# Altium schematic sheet LOGIC_IO.SchDoc
size Tabloid; SheetNumber: 5; SheetTotal: 9
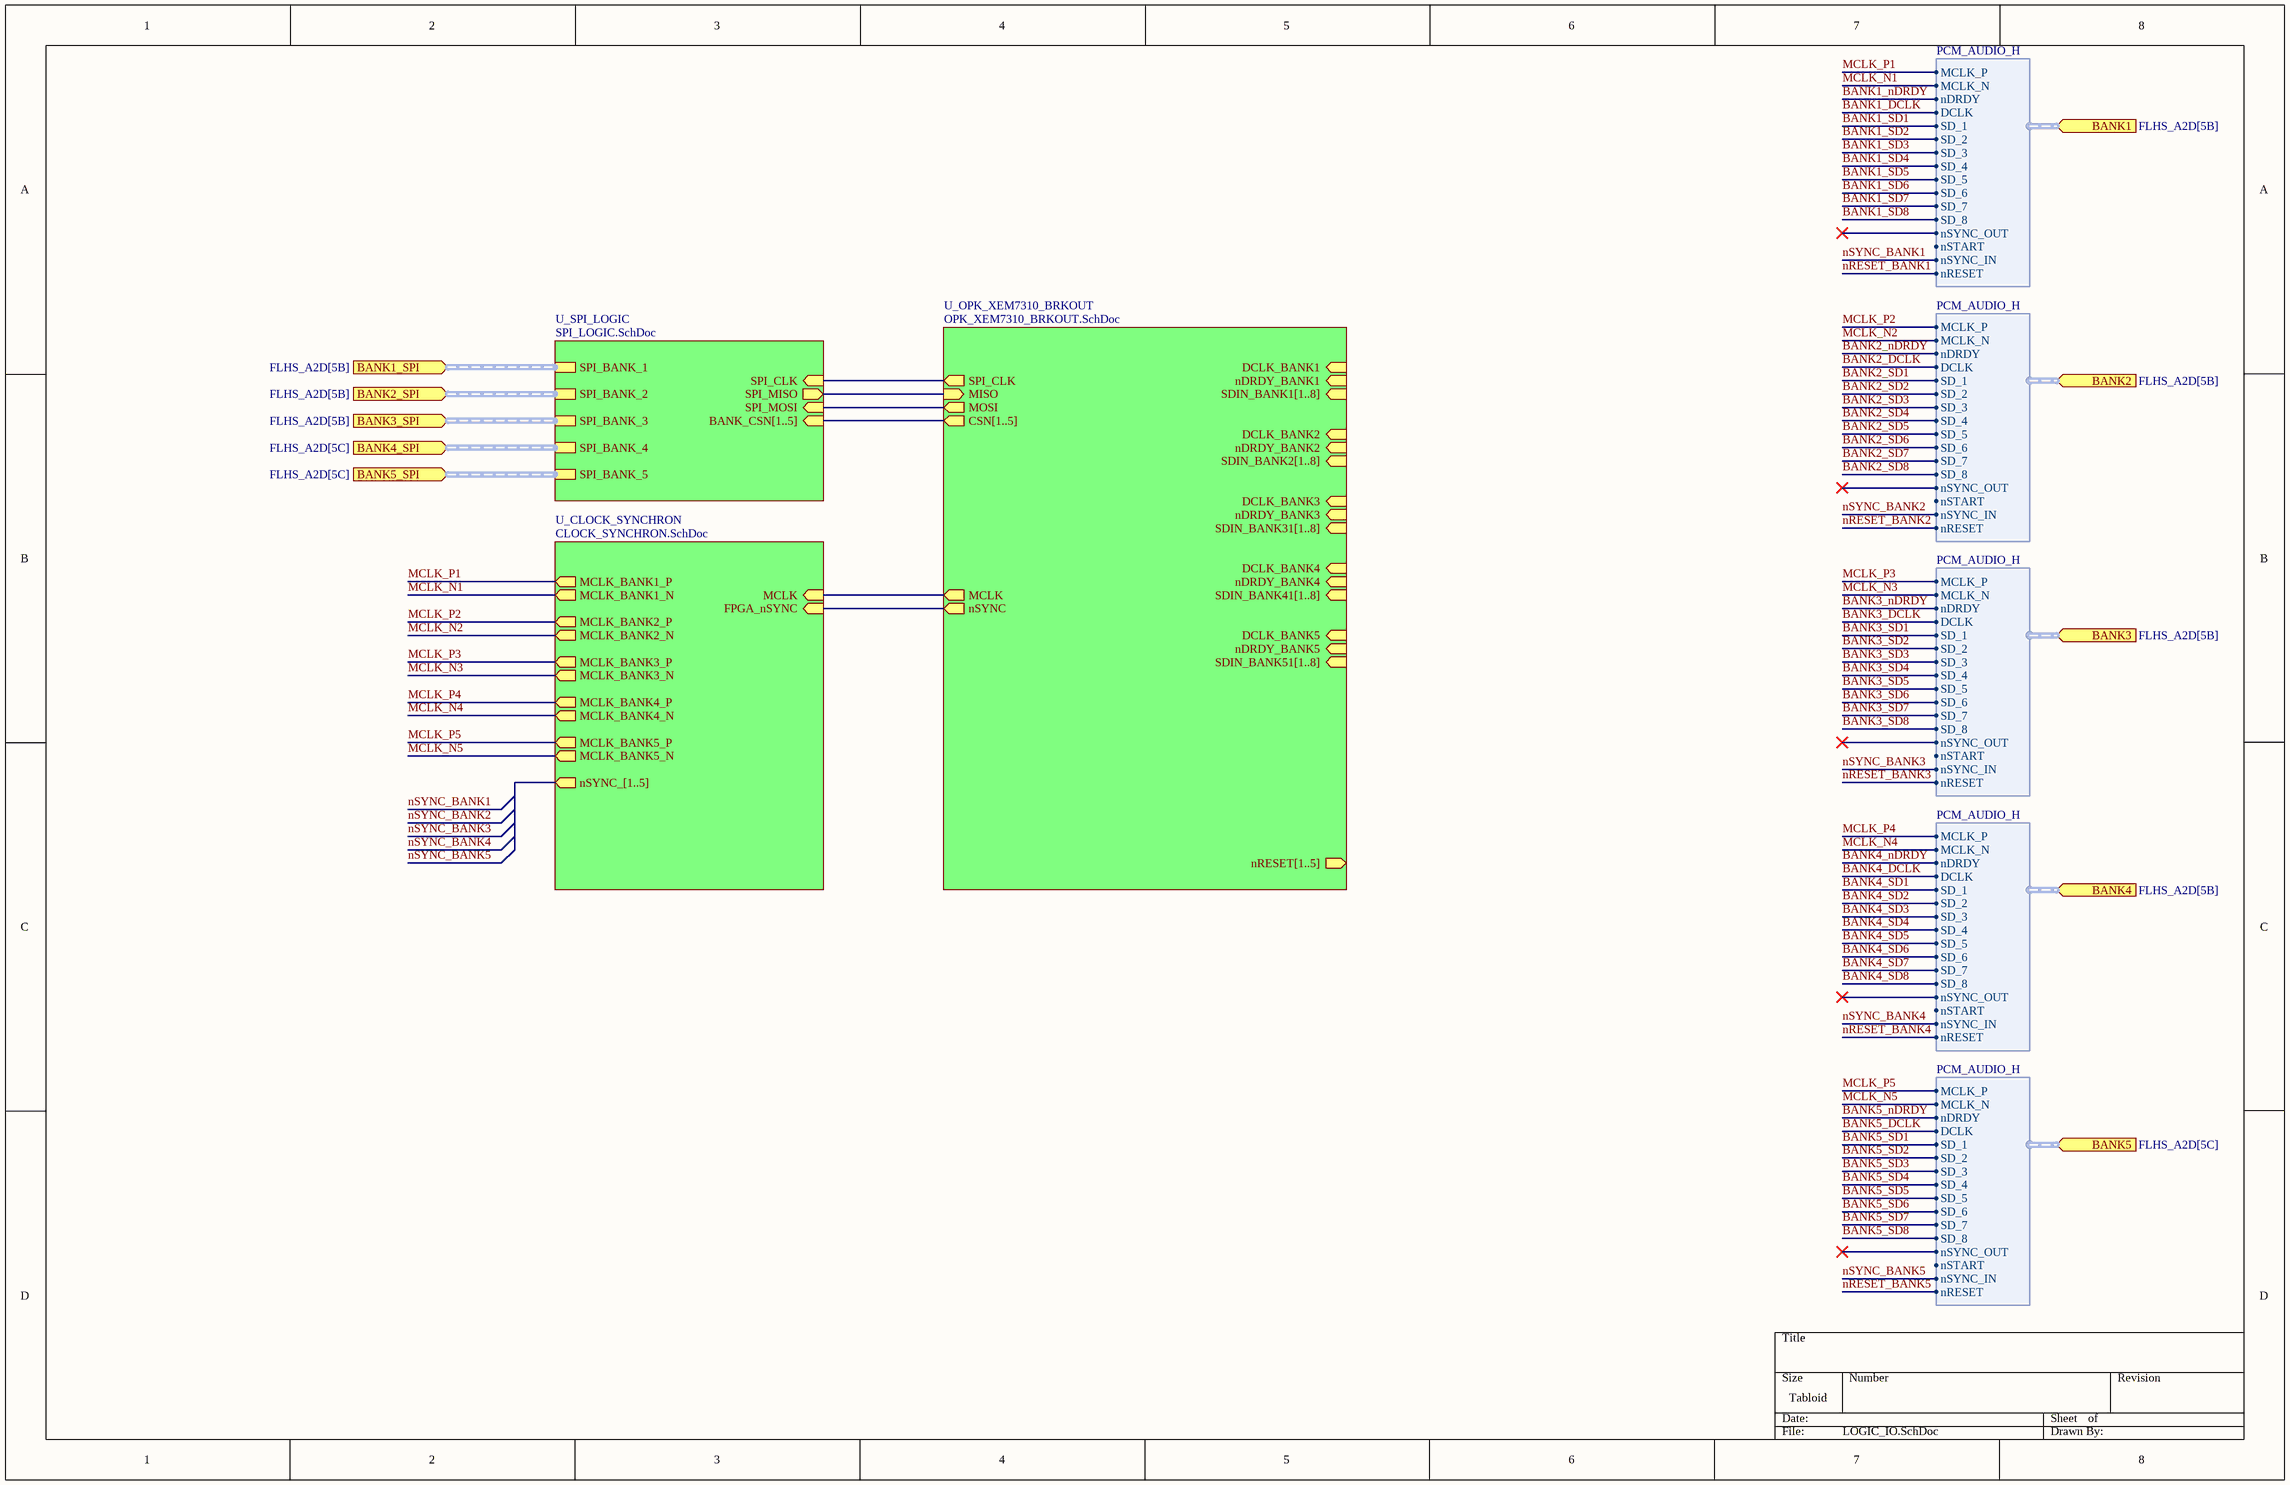
[diagram p0: LOGIC_IO.SchDoc]

## Sub-sheets
U_CLOCK_SYNCHRON = CLOCK_SYNCHRON.SchDoc: MCLK_BANK1_P (out), MCLK_BANK1_N (out), MCLK_BANK2_P (out), MCLK_BANK2_N (out), MCLK_BANK3_P (out), MCLK_BANK3_N (out), MCLK_BANK4_P (out), MCLK_BANK4_N (out), MCLK_BANK5_P (out), MCLK_BANK5_N (out), MCLK (in), nSYNC_[1..5] (out), FPGA_nSYNC (in)
U_OPK_XEM7310_BRKOUT = OPK_XEM7310_BRKOUT.SchDoc: nRESET[1..5] (out), nDRDY_BANK1 (in), SDIN_BANK1[1..8] (in), nDRDY_BANK2 (in), SDIN_BANK2[1..8] (in), nDRDY_BANK3 (in), SDIN_BANK31[1..8] (in), nDRDY_BANK4 (in), SDIN_BANK41[1..8] (in), nDRDY_BANK5 (in), SDIN_BANK51[1..8] (in), MCLK (out), nSYNC (out), SPI_CLK (out), MOSI (out), MISO (in), CSN[1..5] (out), DCLK_BANK1 (in), DCLK_BANK2 (in), DCLK_BANK3 (in), DCLK_BANK4 (in), DCLK_BANK5 (in)
U_SPI_LOGIC = SPI_LOGIC.SchDoc: SPI_BANK_1 (harness PCM_SPI_CONFIG_H), SPI_BANK_2 (harness PCM_SPI_CONFIG_H), SPI_BANK_3 (harness PCM_SPI_CONFIG_H), SPI_BANK_4 (harness PCM_SPI_CONFIG_H), SPI_BANK_5 (harness PCM_SPI_CONFIG_H), SPI_MISO (out), SPI_CLK (in), SPI_MOSI (in), BANK_CSN[1..5] (in)

## Ports
BANK1 (in, harness PCM_AUDIO_H, see FLHS_A2D[5B]), BANK1_SPI (in, harness PCM_SPI_CONFIG_H, see FLHS_A2D[5B]), BANK2 (in, harness PCM_AUDIO_H, see FLHS_A2D[5B]), BANK2_SPI (in, harness PCM_SPI_CONFIG_H, see FLHS_A2D[5B]), BANK3 (in, harness PCM_AUDIO_H, see FLHS_A2D[5B]), BANK3_SPI (in, harness PCM_SPI_CONFIG_H, see FLHS_A2D[5B]), BANK4 (in, harness PCM_AUDIO_H, see FLHS_A2D[5B]), BANK4_SPI (in, harness PCM_SPI_CONFIG_H, see FLHS_A2D[5C]), BANK5 (in, harness PCM_AUDIO_H, see FLHS_A2D[5C]), BANK5_SPI (in, harness PCM_SPI_CONFIG_H, see FLHS_A2D[5C])

## Harnesses
PCM_AUDIO_H: MCLK_P, nDRDY, DCLK, SD_1, SD_2, SD_3, SD_4, nRESET, SD_5, SD_6, SD_7, SD_8, nSYNC_IN, nSYNC_OUT, nSTART, MCLK_N

## Nets
BANK1_DCLK: port BANK1.DCLK
BANK1_nDRDY: port BANK1.nDRDY
BANK1_SD1: port BANK1.SD_1
BANK1_SD2: port BANK1.SD_2
BANK1_SD3: port BANK1.SD_3
BANK1_SD4: port BANK1.SD_4
BANK1_SD5: port BANK1.SD_5
BANK1_SD6: port BANK1.SD_6
BANK1_SD7: port BANK1.SD_7
BANK1_SD8: port BANK1.SD_8
BANK2_DCLK: port BANK2.DCLK
BANK2_nDRDY: port BANK2.nDRDY
BANK2_SD1: port BANK2.SD_1
BANK2_SD2: port BANK2.SD_2
BANK2_SD3: port BANK2.SD_3
BANK2_SD4: port BANK2.SD_4
BANK2_SD5: port BANK2.SD_5
BANK2_SD6: port BANK2.SD_6
BANK2_SD7: port BANK2.SD_7
BANK2_SD8: port BANK2.SD_8
BANK3_DCLK: port BANK3.DCLK
BANK3_nDRDY: port BANK3.nDRDY
BANK3_SD1: port BANK3.SD_1
BANK3_SD2: port BANK3.SD_2
BANK3_SD3: port BANK3.SD_3
BANK3_SD4: port BANK3.SD_4
BANK3_SD5: port BANK3.SD_5
BANK3_SD6: port BANK3.SD_6
BANK3_SD7: port BANK3.SD_7
BANK3_SD8: port BANK3.SD_8
BANK4_DCLK: port BANK4.DCLK
BANK4_nDRDY: port BANK4.nDRDY
BANK4_SD1: port BANK4.SD_1
BANK4_SD2: port BANK4.SD_2
BANK4_SD3: port BANK4.SD_3
BANK4_SD4: port BANK4.SD_4
BANK4_SD5: port BANK4.SD_5
BANK4_SD6: port BANK4.SD_6
BANK4_SD7: port BANK4.SD_7
BANK4_SD8: port BANK4.SD_8
BANK5_DCLK: port BANK5.DCLK
BANK5_nDRDY: port BANK5.nDRDY
BANK5_SD1: port BANK5.SD_1
BANK5_SD2: port BANK5.SD_2
BANK5_SD3: port BANK5.SD_3
BANK5_SD4: port BANK5.SD_4
BANK5_SD5: port BANK5.SD_5
BANK5_SD6: port BANK5.SD_6
BANK5_SD7: port BANK5.SD_7
BANK5_SD8: port BANK5.SD_8
MCLK_N1: sheet U_CLOCK_SYNCHRON/MCLK_BANK1_N, port BANK1.MCLK_N
MCLK_N2: sheet U_CLOCK_SYNCHRON/MCLK_BANK2_N, port BANK2.MCLK_N
MCLK_N3: sheet U_CLOCK_SYNCHRON/MCLK_BANK3_N, port BANK3.MCLK_N
MCLK_N4: sheet U_CLOCK_SYNCHRON/MCLK_BANK4_N, port BANK4.MCLK_N
MCLK_N5: sheet U_CLOCK_SYNCHRON/MCLK_BANK5_N, port BANK5.MCLK_N
MCLK_P1: sheet U_CLOCK_SYNCHRON/MCLK_BANK1_P, port BANK1.MCLK_P
MCLK_P2: sheet U_CLOCK_SYNCHRON/MCLK_BANK2_P, port BANK2.MCLK_P
MCLK_P3: sheet U_CLOCK_SYNCHRON/MCLK_BANK3_P, port BANK3.MCLK_P
MCLK_P4: sheet U_CLOCK_SYNCHRON/MCLK_BANK4_P, port BANK4.MCLK_P
MCLK_P5: sheet U_CLOCK_SYNCHRON/MCLK_BANK5_P, port BANK5.MCLK_P
nRESET_BANK1: port BANK1.nRESET
nRESET_BANK2: port BANK2.nRESET
nRESET_BANK3: port BANK3.nRESET
nRESET_BANK4: port BANK4.nRESET
nRESET_BANK5: port BANK5.nRESET
nSYNC_BANK1: port BANK1.nSYNC_IN
nSYNC_BANK2: port BANK2.nSYNC_IN
nSYNC_BANK3: port BANK3.nSYNC_IN
nSYNC_BANK4: port BANK4.nSYNC_IN
nSYNC_BANK5: port BANK5.nSYNC_IN
(unnamed): sheet U_SPI_LOGIC/SPI_MISO, sheet U_OPK_XEM7310_BRKOUT/MISO
(unnamed): sheet U_SPI_LOGIC/SPI_CLK, sheet U_OPK_XEM7310_BRKOUT/SPI_CLK
(unnamed): sheet U_SPI_LOGIC/SPI_MOSI, sheet U_OPK_XEM7310_BRKOUT/MOSI
(unnamed): sheet U_OPK_XEM7310_BRKOUT/MCLK, sheet U_CLOCK_SYNCHRON/MCLK
(unnamed): sheet U_OPK_XEM7310_BRKOUT/nSYNC, sheet U_CLOCK_SYNCHRON/FPGA_nSYNC

## Buses and harness runs
bus sheet U_OPK_XEM7310_BRKOUT/CSN[1..5] = sheet U_SPI_LOGIC/BANK_CSN[1..5]
harness port BANK1_SPI = sheet U_SPI_LOGIC/SPI_BANK_1
harness port BANK2_SPI = sheet U_SPI_LOGIC/SPI_BANK_2
harness port BANK3_SPI = sheet U_SPI_LOGIC/SPI_BANK_3
harness port BANK4_SPI = sheet U_SPI_LOGIC/SPI_BANK_4
harness port BANK5_SPI = sheet U_SPI_LOGIC/SPI_BANK_5